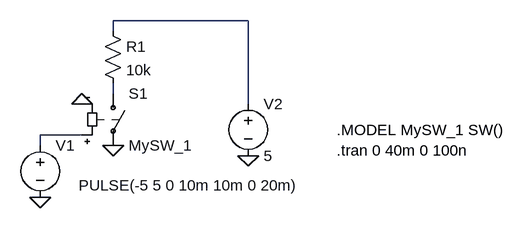
[diagram p0: schematic Switch_Example_1.asc]
Switch_Example_1.asc, the LTspice schematic file:
Version 4
SHEET 1 1504 680
WIRE 64 48 -144 48
WIRE -144 64 -144 48
WIRE -144 160 -144 144
WIRE 64 176 64 48
WIRE -192 224 -256 224
WIRE -256 240 -256 224
FLAG -256 320 0
FLAG -192 176 0
FLAG -144 240 0
FLAG 64 256 0
SYMBOL sw -144 144 R0
SYMATTR InstName S1
SYMATTR Value MySW_1
SYMBOL voltage -256 224 R0
WINDOW 3 398 78 Right 2
WINDOW 123 0 0 Left 0
WINDOW 39 0 0 Left 0
SYMATTR Value PULSE(-5 5 0 10m 10m 0 20m)
SYMATTR InstName V1
SYMBOL voltage 64 160 R0
WINDOW 123 0 0 Left 0
WINDOW 39 0 0 Left 0
SYMATTR InstName V2
SYMATTR Value 5
SYMBOL res -160 48 R0
SYMATTR InstName R1
SYMATTR Value 10k
TEXT 200 248 Left 2 !.tran 0 40m 0 100n
TEXT 200 216 Left 2 !.MODEL MySW_1 SW()

The netlist it stands for:
* Switch_Example_1.asc
S1 N002 0 N003 0 MySW_1
V1 N003 0 PULSE(-5 5 0 10m 10m 0 20m)
V2 N001 0 5
R1 N001 N002 10k
.tran 0 40m 0 100n
.MODEL MySW_1 SW()
.backanno
.end